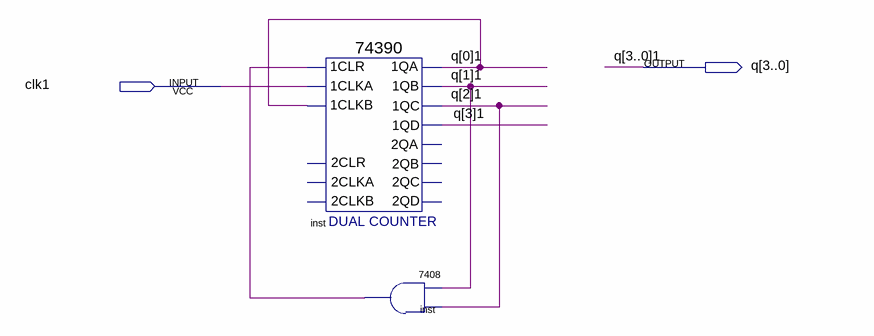
[diagram p0: schematic sheet]
// Quartus schematic Task_One.bdf as structural Verilog: 2 symbols, 2 pins
module Task_One (
  input  clk1,
  output [3:0] q
);

  wire inst_1, \q[0]1 , \q[1]1 , \q[2]1 , \q[3]1 ;

  \74390  inst (
    .\1CLR (inst_1), .\1CLKA (clk1), .\1CLKB (\q[0]1 ), .\1QA (\q[0]1 ), .\1QB (\q[1]1 ), .\1QC (\q[2]1 ),
    .\1QD (\q[3]1 ));  // open: 2CLKA, 2CLR, 2CLKB, 2QA, 2QB, 2QC, 2QD
  \7408  inst_dup2 (.\3 (\q[2]1 ), .\2 (\q[1]1 ), .\1 (inst_1));
endmodule
